# Altium schematic sheet SwitchBoard_v3.SchDoc
size A
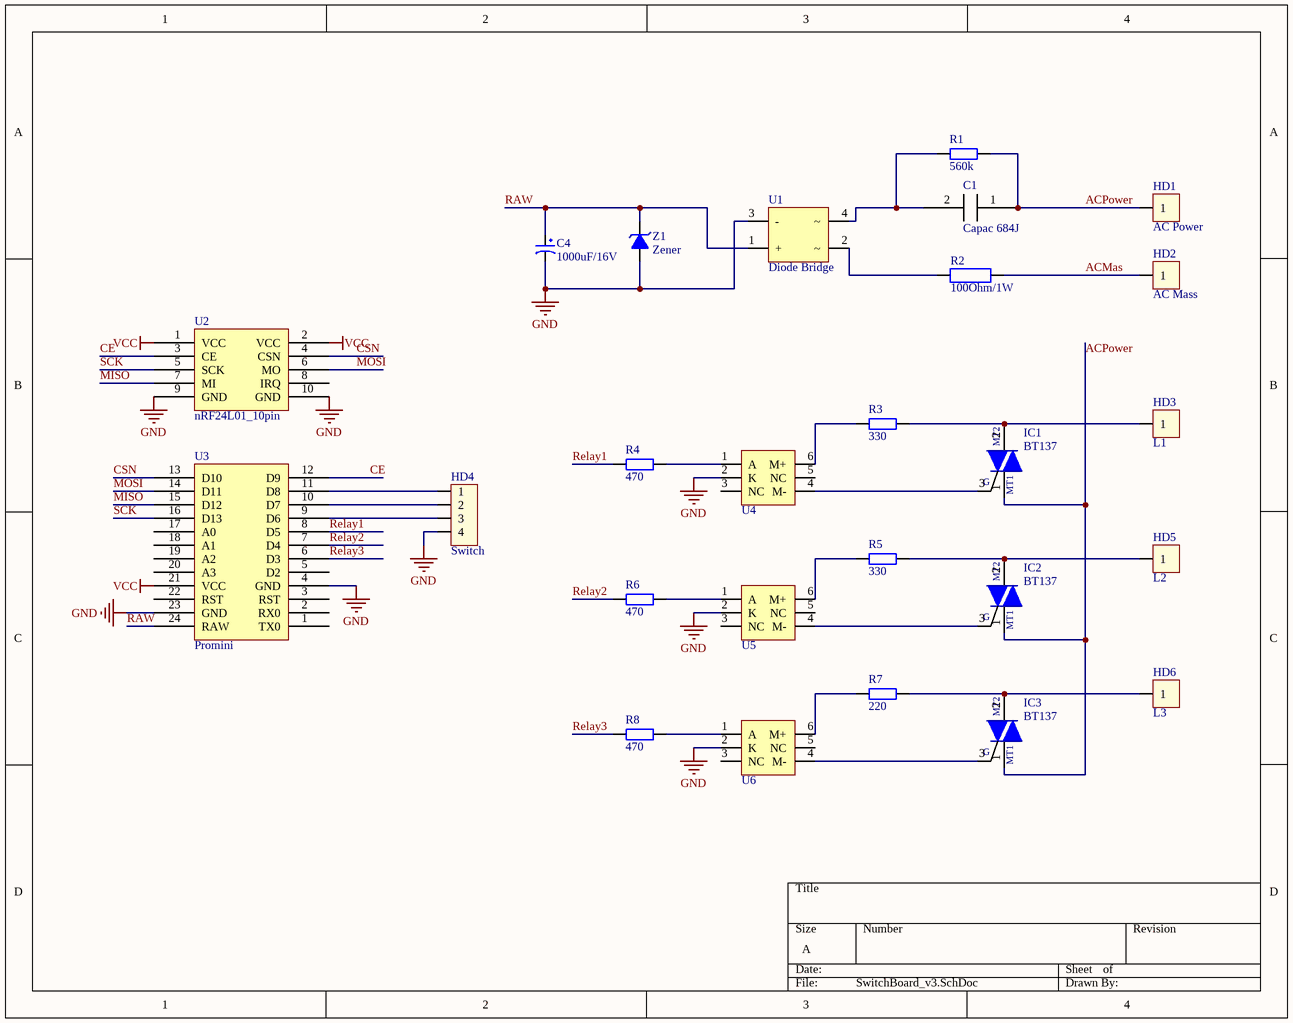
[diagram p0: SwitchBoard_v3.SchDoc]

## Parts
C1  Capac 684J  [Tu keo 684J 400V]
C4  1000uF/16V  [CP2/4]
HD1  AC Power  [DOMINO1]
HD2  AC Mass  [DOMINO1]
HD3  L1  [DOMINO1]
HD4  Switch  [DOMINO_MINI_4]
HD5  L2  [DOMINO1]
HD6  L3  [DOMINO1]
IC1  BT137  [QTO-220]
IC2  BT137  [QTO-220]
IC3  BT137  [QTO-220]
R1  560k  [R1/4W]
R2  100Ohm/1W  [RES1W]
R3  330  [R1/4W]
R4  470  [R1/4W]
R5  330  [R1/4W]
R6  470  [R1/4W]
R7  220  [R1/4W]
R8  470  [R1/4W]
U1  Diode Bridge  [DIODE BRIDGE]
U2  nRF24L01_10pin  [NRF24L01_10PIN]
U3  Promini  [Promini]
U4  MOC3021M  [MOC30XX]  (value not drawn)
U5  MOC3021M  [MOC30XX]  (value not drawn)
U6  MOC3021M  [MOC30XX]  (value not drawn)
Z1  Zener  [D1A]

## Nets
GND: C4.2 HD4.4 U1.3(-) U2.9(GND) U2.10(GND) U3.4(GND) U3.23(GND) U4.2(K) U5.2(K) U6.2(K) Z1.1(A)
VCC: U2.1(VCC) U2.2(VCC) U3.21(VCC)
ACMas: HD2.1 R2.2
ACPower: C1.1 HD1.1 IC1.1(MT1) IC2.1(MT1) IC3.1(MT1) R1.2
CE: U2.3(CE) U3.12(D9)
CSN: U2.4(CSN) U3.13(D10)
MISO: U2.7(MI) U3.15(D12)
MOSI: U2.6(MO) U3.14(D11)
RAW: C4.1 U1.1(+) U3.24(RAW) Z1.2(K)
Relay1: R4.1 U3.8(D5)
Relay2: R6.1 U3.7(D4)
Relay3: R8.1 U3.6(D3)
SCK: U2.5(SCK) U3.16(D13)
NetC1_2: C1.2 R1.1 U1.4
NetHD3_1: HD3.1 IC1.2(MT2) R3.2
NetHD4_1: HD4.1 U3.11(D8)
NetHD4_2: HD4.2 U3.10(D7)
NetHD4_3: HD4.3 U3.9(D6)
NetHD5_1: HD5.1 IC2.2(MT2) R5.2
NetHD6_1: HD6.1 IC3.2(MT2) R7.2
NetIC1_3: IC1.3(IN) U4.4(M-)
NetIC2_3: IC2.3(IN) U5.4(M-)
NetIC3_3: IC3.3(IN) U6.4(M-)
NetR2_1: R2.1 U1.2
NetR3_1: R3.1 U4.6(M+)
NetR4_2: R4.2 U4.1(A)
NetR5_1: R5.1 U5.6(M+)
NetR6_2: R6.2 U5.1(A)
NetR7_1: R7.1 U6.6(M+)
NetR8_2: R8.2 U6.1(A)

Not connected (* = marked no-connect by the designer): U2 8(IRQ); U3 1(TX0) 2(RX0) 3(RST) 5(D2) 17(A0) 18(A1) 19(A2) 20(A3) 22(RST); U4 3(NC) 5(NC); U5 3(NC) 5(NC); U6 3(NC) 5(NC)

## Notes on the sheet
- (in symbol BT137) G

## Library data of the parts
C1 = Tu keo 684J 400V
C4 = CP5: Cap 2200uF/16V - 1000uF/50V; Description 5: 47uF/200V - 22uF/350V - 400V - 10uF/450V; Description 1: 4700uF-6800uF/6,3V - 3300uF-4700uF/10V; Description 2: 2200uF-3300uF/16V - 470uF => 2200uF/25V; Description 3: 1000uF/35V-50V_470uF/63V_220uF>330uF/100V; Description 4: 47uF => 100uF/160V - 33uF-47uF/250V; Value: 2200uF/16V
HD1-HD3 HD5 HD6 = Domino1: Header 2 (Green); Value: Header 2
HD4 = DominoMini4: Header 2 (Green); Value: Header 2
IC1-IC3 = BT137: Triacs - 8A; Value: LM317
R1 R3-R8 = R1/4W: Resistor 1/4W; Value: R1/4W - 1K
R2 = Res 1W: 1W Res Power; Creator: Nguyen Ba Bien